# EasyEDA schematic PAPR_STM32F030F4_V2.json
TITLE: PAPR STM32F030F4; REV: 2.0; Date: 2020-04-01; Sheet: 1/1; Drawn By: Márk Péter Vargha; Company: NowTechnologies Ltd
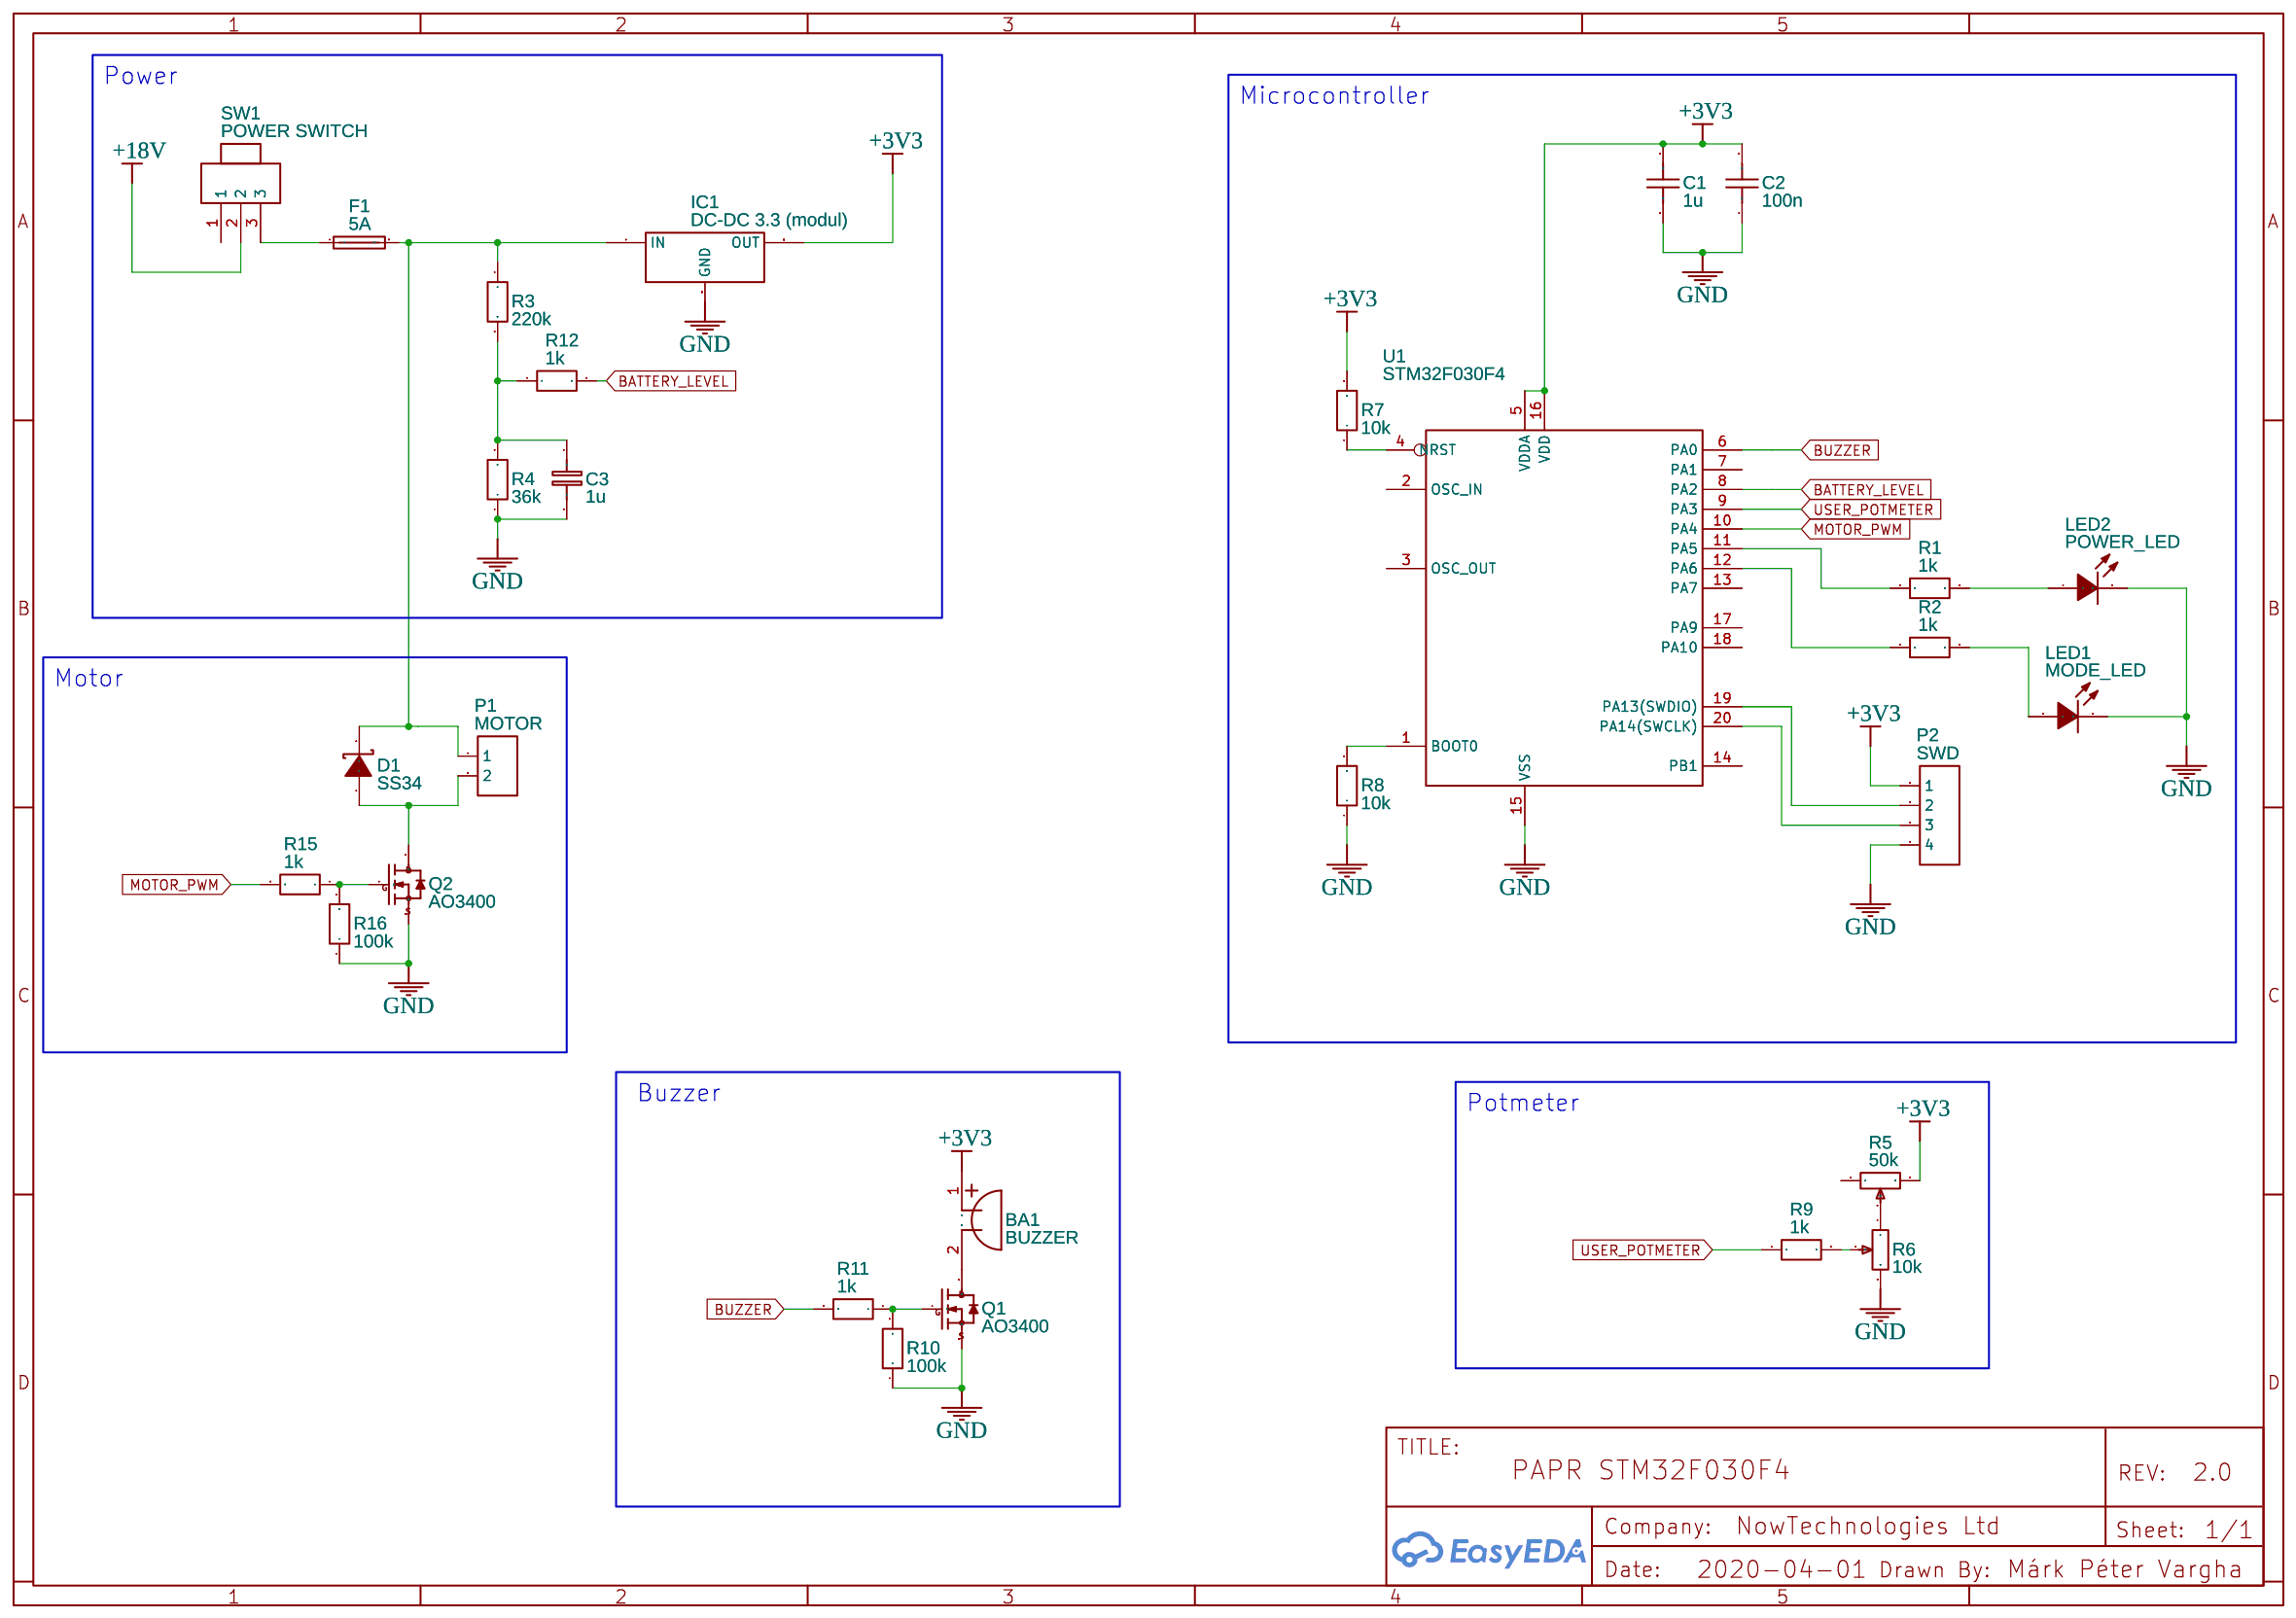
[diagram p0: schematic sheet]

## Parts
BA1  BUZZER  [BEEPER_HC0905F_9.5X4.0MM]
C1  1u  [RAD-0.1]
C2  100n  [RAD-0.1]
C3  1u  [RAD-0.1]
D1  SS34  [SMC_L7.1-W6.2-LS8.1-FD]
F1  5A  [FUSE-SMD_5*20MM]
IC1  DC-DC 3.3 (modul)  [AMS1117 3.3]
LED1  MODE_LED  [LED-3MM/2.54]
LED2  POWER_LED  [LED-3MM/2.54]
P1  MOTOR  [HDR-TH_2P-P2.54-V-M]
P2  SWD  [5268-4P]
Q1  AO3400  [SC-59-3_L2.9-W1.5-P0.95-LS2.5-BR]
Q2  AO3400  [SC-59-3_L2.9-W1.5-P0.95-LS2.5-BR]
R1  1k  [AXIAL-0.3]
R2  1k  [AXIAL-0.3]
R3  220k  [AXIAL-0.3]
R4  36k  [AXIAL-0.3]
R5  50k  [POTMETER]
R6  10k  [POTMETER]
R7  10k  [AXIAL-0.3]
R8  10k  [AXIAL-0.3]
R9  1k  [AXIAL-0.3]
R10  100k  [AXIAL-0.3]
R11  1k  [AXIAL-0.3]
R12  1k  [AXIAL-0.3]
R15  1k  [AXIAL-0.3]
R16  100k  [AXIAL-0.3]
SW1  POWER SWITCH  [601-10211BB-3P]
U1  STM32F030F4  [TSSOP-20]

## Library data of the parts
BA1 = 9X5.5_BEEPER_5V: Contributor: customyota
C1 = Cap_RAD-0.1_US
C2 = Cap_RAD-0.1_US: Package Display: No
C3 = Cap_RAD-0.1_EU
D1 = SS34: Supplier: LCSC; Manufacturer: MDD; image: //image.lceda.cn/szlcsc/C13763.jpg; Supplier Part: C13763; LCSC Assembly: Yes; SMT Type: Extend
F1 = 5F 5A 250VACGlass tube fuse: Supplier: LCSC; Manufacturer: XCFuse; image: //image.lceda.cn/szlcsc/C3120.jpg; Supplier Part: C3120
IC1 = AMS1117 3.3: sourceId: OUgBz5nhN
LED1 LED2 = 204-10SURD/S530-A3: Supplier: LCSC; Manufacturer: EVERLIGHT; Supplier Part: C99772
P1 = Header-Female-2.54_1x2: Supplier: LCSC; Manufacturer: BOOMELE; Manufacturer Part: 2.54-1*2PFemale; image: //image.lceda.cn/szlcsc/C49661.jpg; Supplier Part: C49661
P2 = 4P: Contributor: kwang0621
Q1 Q2 = AO3400_C122850: Supplier: LCSC; Manufacturer: SK; Contributor: 立创EDA官方封装库; Supplier Part: C122850; LCSC Assembly: Yes; SMT Type: Extend
R1-R4 R7-R12 R15 R16 = Res_AXIAL-0.3(1/8W)_EU
R5 R6 = potmeter: Supplier: LCSC; Manufacturer: Bochen; Manufacturer Part: 3386P-1-101LF; Resistance(Ohms): 100; Supplier Part: C125022
SW1 = Rocker switch601-10211BB: Supplier: LCSC; Manufacturer: BBJ; image: //image.lceda.cn/szlcsc/C67849.jpg; Supplier Part: C67849
U1 = STM32F030F4: Contributor: eXtreme; sourceId: E0UO60izt

## Nets
+3V3: BA1.1 C1.2 C2.2 IC1.OUT P2.1 R5.3 R7.2 U1.5(VDDA) U1.16(VDD)
+18V: SW1.2
GND: C1.1 C2.1 C3.2 IC1.GND LED1.2(K) LED2.2(K) P2.4 Q1.2(S) Q2.2(S) R4.1 R6.3 R8.1 R10.1 R16.1 U1.15(VSS)
BATTERY_LEVEL: R12.2 U1.8(PA2)
BUZZER: R11.2 U1.6(PA0)
MOTOR_PWM: R15.2 U1.10(PA4)
USER_POTMETER: R9.1 U1.9(PA3)
Net-(BA1-2): BA1.2 Q1.3(D)
Net-(C3-1): C3.1 R3.2 R4.2 R12.1
Net-(D1-1): D1.1(A) P1.2 Q2.3(D)
Net-(D1-2): D1.2(K) F1.2 IC1.IN P1.1 R3.1
Net-(F1-1): F1.1 SW1.3
Net-(LED1-1): LED1.1(A) R2.2
Net-(LED2-1): LED2.1(A) R1.2
Net-(P2-2): P2.2 U1.19(PA13(SWDIO))
Net-(P2-3): P2.3 U1.20(PA14(SWCLK))
Net-(Q1-1): Q1.1(G) R10.2 R11.1
Net-(Q2-1): Q2.1(G) R15.1 R16.2
Net-(R1-1): R1.1 U1.11(PA5)
Net-(R2-1): R2.1 U1.12(PA6)
Net-(R5-2): R5.2 R6.1
Net-(R6-2): R6.2 R9.2
Net-(R7-1): R7.1 U1.4(NRST)
Net-(R8-2): R8.2 U1.1(BOOT0)

Not connected (* = marked no-connect by the designer): R5 1; SW1 1; U1 2(OSC_IN) 3(OSC_OUT) 7(PA1) 13(PA7) 14(PB1) 17(PA9) 18(PA10)

## Notes on the sheet
- Power
- Microcontroller
- Motor
- Buzzer
- Potmeter
